# EAGLE design ProtoHu_rev_B_layer1 (EAGLE 9.4.0)
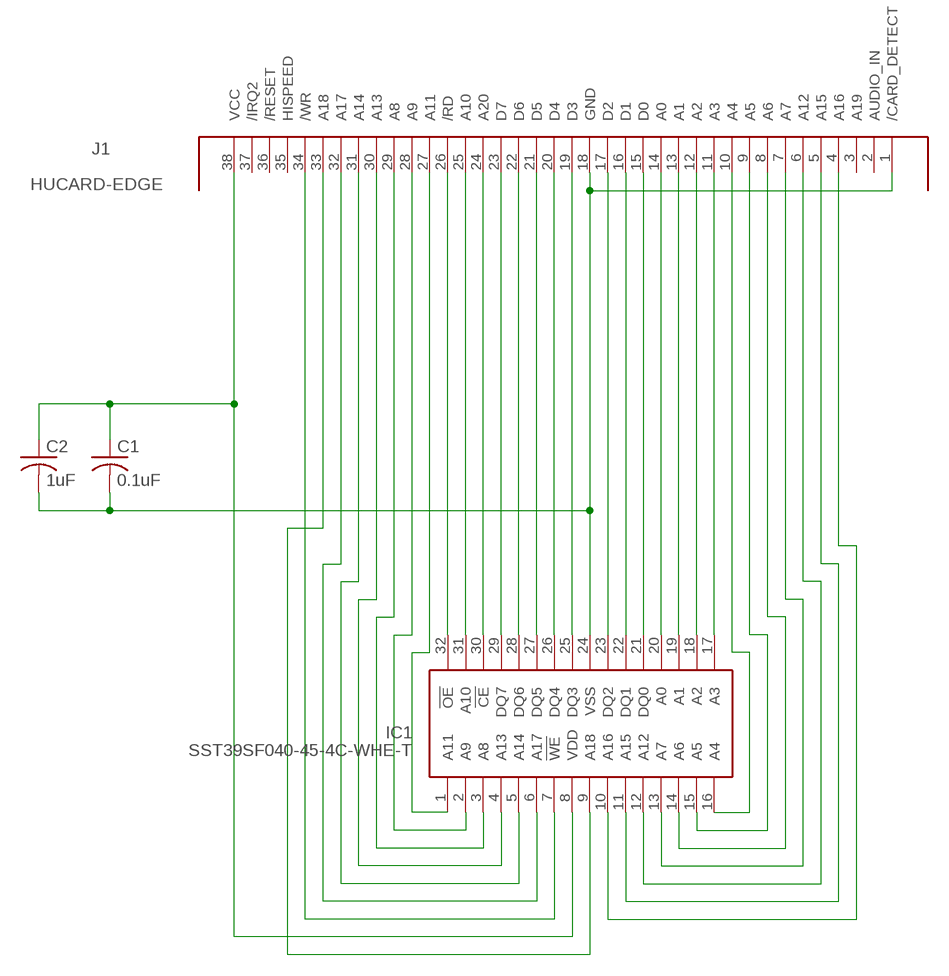
[diagram p0: schematic, sheet 1]

## Parts
C1  0.1uF  C-USC0603  [C0603]
C2  1uF  C-USC0603  [C0603]
IC1  SST39SF040-45-4C-WHE-T  [SOP50P1400X120-32N]
J1  HUCARD-EDGE  [HUCARD-EDGE]

## Nets
GND: C1.2 C2.2 IC1.24(VSS) J1.1(/CARD_DETECT) J1.18(GND)
N$2: IC1.13(A7) J1.7(A7)
N$3: IC1.12(A12) J1.6(A12)
N$4: IC1.25(DQ3) J1.19(D3)
N$5: IC1.14(A6) J1.8(A6)
N$7: IC1.11(A15) J1.5(A15)
N$8: IC1.10(A16) J1.4(A16)
N$12: IC1.16(A4) J1.10(A4)
N$14: IC1.15(A5) J1.9(A5)
N$15: IC1.17(A3) J1.11(A3)
N$16: IC1.18(A2) J1.12(A2)
N$17: IC1.31(A10) J1.25(A10)
N$18: IC1.32(!OE) J1.26(/RD)
N$19: IC1.1(A11) J1.27(A11)
N$20: IC1.2(A9) J1.28(A9)
N$25: IC1.3(A8) J1.29(A8)
N$26: IC1.19(A1) J1.13(A1)
N$27: IC1.20(A0) J1.14(A0)
N$28: IC1.21(DQ0) J1.15(D0)
N$31: IC1.9(A18) J1.33(A18)
N$33: IC1.7(!WE) J1.34(/WR)
N$34: IC1.22(DQ1) J1.16(D1)
N$35: IC1.6(A17) J1.32(A17)
N$36: IC1.5(A14) J1.31(A14)
N$37: IC1.4(A13) J1.30(A13)
N$38: IC1.23(DQ2) J1.17(D2)
N$42: IC1.30(!CE) J1.24(A20)
N$43: IC1.29(DQ7) J1.23(D7)
N$44: IC1.28(DQ6) J1.22(D6)
N$45: IC1.26(DQ4) J1.20(D4)
N$46: IC1.27(DQ5) J1.21(D5)
VCC: C1.1 C2.1 IC1.8(VDD) J1.38(VCC)
Unconnected: J1.2(AUDIO_IN) J1.3(A19) J1.35(HISPEED) J1.36(/RESET) J1.37(/IRQ2)

## Library data of the parts
C1 C2 = resistor:C-US: CAPACITOR, American symbol
IC1 = PC-Engine:SST39SF040-45-4C-WHE-T: Flash Memory 4.5 to 5.5 4Mbit Multi-Purpose Flash Source: Datasheet <https://componentsearchengine.com/Datasheets/1/SST39SF040-45-4C-WHE-T.pdf>; DESCRIPTION: Flash Memory 4.5 to 5.5 4Mbit Multi-Purpose Flash; HEIGHT: 1.2mm; MANUFACTURER_NAME: Microchip; MANUFACTURER_PART_NUMBER: SST39SF040-45-4C-WHE-T; MOUSER_PART_NUMBER: 579-39SF0404CWHET; MOUSER_PRICE-STOCK: https://www.mouser.com/Search/Refine.aspx?Keyword=579-39SF0404CWHET
J1 = PC-Engine:HUCARD-EDGE: This is a card-edge connector for PC Engine HuCards. The package origin identifies the corner of an un-mitered HuCard. There is a mask 'kepout' area at the edges to allow for artwork/soldermask at the edge

## Board
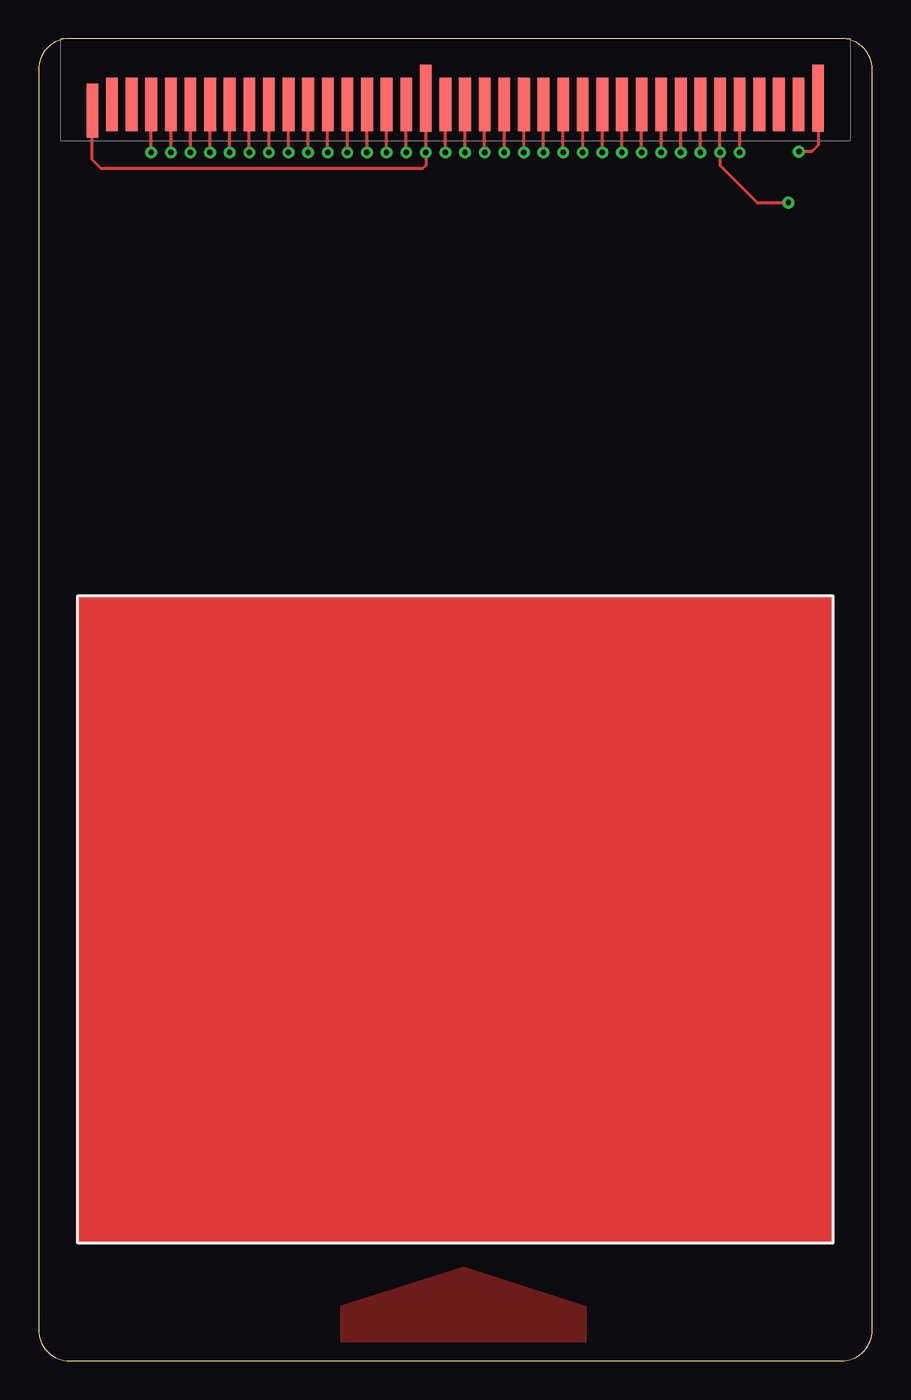
[diagram p1: board, top side]
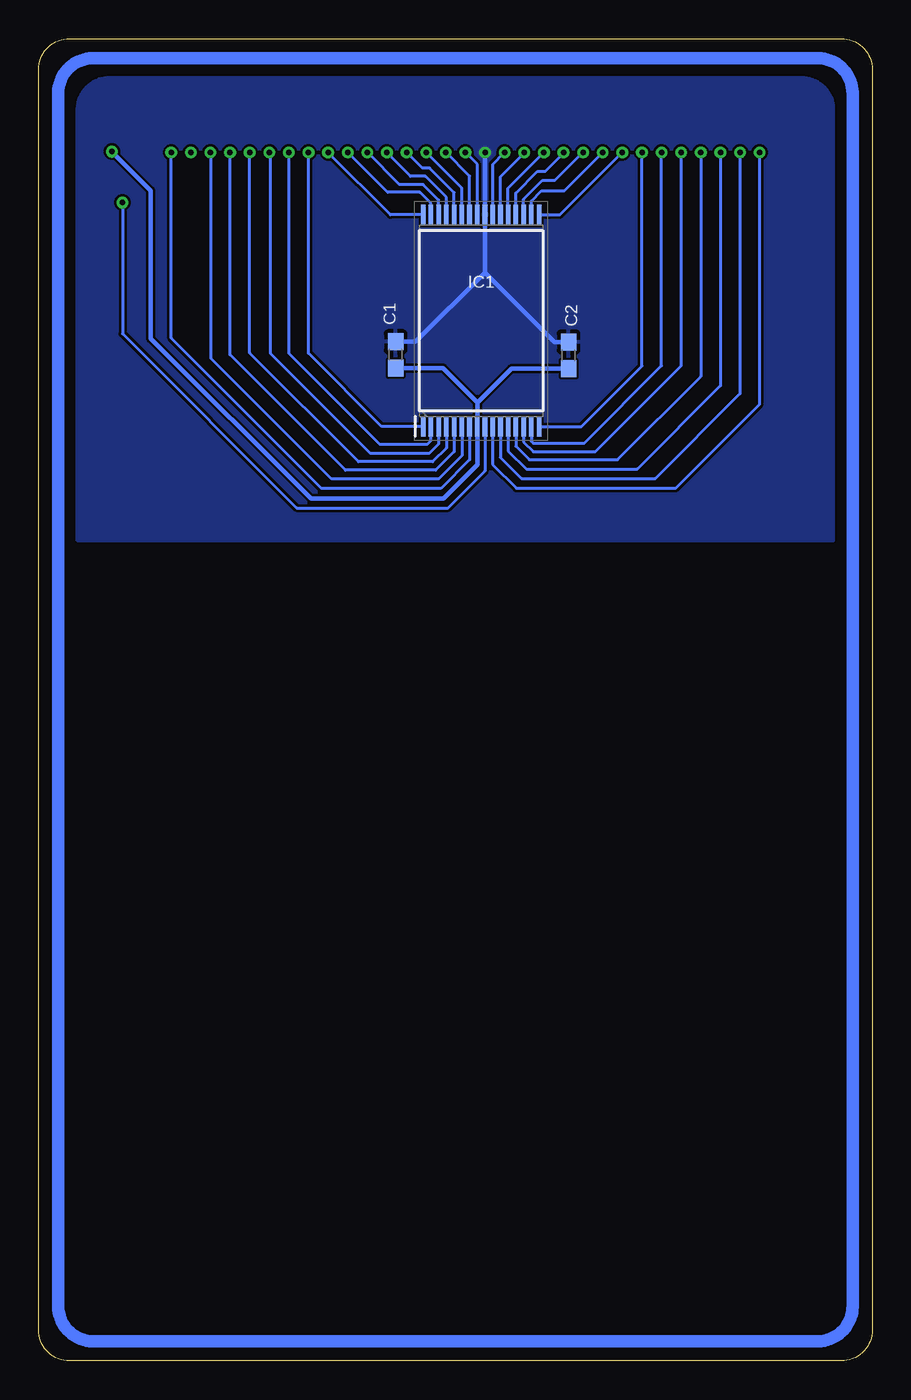
[diagram p2: board, bottom side, seen from below]

Size 53.98 x 85.6 mm. Coordinates in mm from the lower left corner, seen from the top.
Outline: 0,83.6 0,2 arc90 2,0 51.98,0 arc90 53.98,2 53.98,83.6 arc90 51.98,85.6 2,85.6 arc90 0,83.6
Copper layers (1*16): Top 0.035mm / dielectric 1.5mm / Bottom 0.035mm
Design rules "default *": minimum track width 6mil, minimum drill 0.35mm, track to track 6mil, track to pad 6mil, pad to pad 6mil, via to via 6mil, smd to smd 6mil, copper to edge 30mil, drill to drill 6mil, minimum pad ring 10mil, minimum via ring 8mil, stop-mask expansion 4mil, vias tented up to drill 15mil, thermal gap 10mil

### Footprints (pad centres in the part's own frame; a part is rotated, then mirrored left to right if it is on the bottom)
C0603 = smd 1.1 x 1: 1 -0.85,0; 2 0.85,0
SOP50P1400X120-32N = smd 1.3 x 0.3: 1 -6.85,3.75; 2 -6.85,3.25; 3 -6.85,2.75; 4 -6.85,2.25; 5 -6.85,1.75; 6 -6.85,1.25; 7 -6.85,0.75; 8 -6.85,0.25; 9 -6.85,-0.25; 10 -6.85,-0.75; 11 -6.85,-1.25; 12 -6.85,-1.75; 13 -6.85,-2.25; 14 -6.85,-2.75; 15 -6.85,-3.25; 16 -6.85,-3.75; 17 6.85,-3.75; 18 6.85,-3.25; 19 6.85,-2.75; 20 6.85,-2.25; 21 6.85,-1.75; 22 6.85,-1.25; 23 6.85,-0.75; 24 6.85,-0.25; 25 6.85,0.25; 26 6.85,0.75; 27 6.85,1.25; 28 6.85,1.75; 29 6.85,2.25; 30 6.85,2.75; 31 6.85,3.25; 32 6.85,3.75
HUCARD-EDGE = smd 0.762 x 3.48: 1 3.48,-4.674; 2 4.75,-4.267; 3 6.02,-4.267; 4 7.29,-4.267; 5 8.56,-4.267; 6 9.83,-4.267; 7 11.1,-4.267; 8 12.37,-4.267; 9 13.64,-4.267; 10 14.91,-4.267; 11 16.18,-4.267; 12 17.45,-4.267; 13 18.72,-4.267; 14 19.99,-4.267; 15 21.26,-4.267; 16 22.53,-4.267; 17 23.8,-4.267; 19 26.34,-4.267; 20 27.61,-4.267; 21 28.88,-4.267; 22 30.15,-4.267; 23 31.42,-4.267; 24 32.69,-4.267; 25 33.96,-4.267; 26 35.23,-4.267; 27 36.5,-4.267; 28 37.77,-4.267; 29 39.04,-4.267; 30 40.31,-4.267; 31 41.58,-4.267; 32 42.85,-4.267; 33 44.12,-4.267; 34 45.39,-4.267; 35 46.66,-4.267; 36 47.93,-4.267; 37 49.2,-4.267 | smd 0.762 x 4.318: 18 25.07,-3.861; 38 50.47,-3.861

### Placement (x,y rotation side)
C1  30.86,65.13 90 bottom
C2  19.66,65.1 90 bottom
IC1  25.32,67.34 90 bottom
J1  0,85.6 0 top

### Tracks (layer width: path | path; a pad name or v marks a point on that pad's centre or on a via)
GND  (via drill 0.35)
  Top 0.203: J1.1 3.48,77.75 4.04,77.19 24.87,77.19 25.07,77.39 v25.07,78.23 J1.18
  Bottom 0.305: 25.07,70.46 IC1.24 v25.07,78.23 | 25.07,70.46 29.56,65.98 C1.2 | C2.2 20.56,65.95 25.07,70.46
  pour Bottom: 2.54,53.11 51.44,53.11 51.44,81.06 arc90 49.33,83.06 4.62,83.06 arc90 2.54,81.06
N$2  (via drill 0.35)
  Top 0.203: v11.1,78.23 J1.7
  Bottom 0.203: v11.1,78.23 11.1,63.73 16.48,58.34 22.2,58.34 23.07,59.22 IC1.13
N$3  (via drill 0.35)
  Top 0.203: v9.83,78.23 J1.6
  Bottom 0.203: v9.83,78.23 9.83,63.12 15.21,57.73 22.4,57.73 23.57,58.91 IC1.12
N$4  (via drill 0.35)
  Top 0.203: v26.34,78.23 J1.19
  Bottom 0.203: v26.34,78.23 25.57,77.47 IC1.25
N$5  (via drill 0.35)
  Top 0.203: v12.37,78.23 J1.8
  Bottom 0.203: v12.37,78.23 12.37,64.41 17.93,58.85 21.95,58.85 22.57,59.48 IC1.14
N$7  (via drill 0.35)
  Top 0.203: J1.5 v8.56,78.23
  Bottom 0.203: v8.56,78.23 8.56,62.61 14.05,57.12 22.71,57.12 24.07,58.49 IC1.11
N$8  (via drill 0.35)
  Top 0.203: v7.29,78.23 J1.4
  Bottom 0.203: v7.29,78.23 7.29,61.92 12.72,56.49 23.04,56.49 24.57,58.03 IC1.10
N$12  (via drill 0.35)
  Top 0.203: v14.91,78.23 J1.10
  Bottom 0.203: IC1.16 18.82,60.48 14.91,64.4 v14.91,78.23
N$13
  Bottom 0.813: 1.27,82.07 arc-90 3.52,84.33 | 3.52,84.33 50.45,84.33 arc-90 52.7,82.07 52.7,3.55 arc-90 50.45,1.27 50.38,1.27 3.52,1.27 arc-90 1.27,3.55 | 1.27,3.6 1.27,82.07 | 1.27,82.07 1.27,82.12 | 1.27,82.07 arc-90 3.52,84.33
N$14  (via drill 0.35)
  Top 0.203: v13.64,78.23 J1.9
  Bottom 0.203: v13.64,78.23 13.64,64.41 18.64,59.41 21.95,59.41 22.07,59.54 IC1.15
N$15  (via drill 0.35)
  Top 0.203: v16.18,78.23 J1.11
  Bottom 0.203: IC1.17 20.23,74.19 v16.18,78.23
N$16  (via drill 0.35)
  Top 0.203: v17.45,78.23 J1.12
  Bottom 0.203: IC1.18 22.07,75.08 21.41,75.74 19.94,75.74 v17.45,78.23
N$17  (via drill 0.35)
  Top 0.203: v33.96,78.23 J1.25
  Bottom 0.203: IC1.31 28.57,74.93 29.29,75.64 31.37,75.64 v33.96,78.23
N$18  (via drill 0.35)
  Top 0.203: v35.23,78.23 J1.26
  Bottom 0.203: IC1.32 31.19,74.19 v35.23,78.22 v35.23,78.23
N$19  (via drill 0.35)
  Top 0.203: v36.5,78.23 J1.27
  Bottom 0.203: IC1.1 31.76,60.48 36.5,65.23 v36.5,78.23
N$20  (via drill 0.35)
  Top 0.203: v37.77,78.23 J1.28
  Bottom 0.203: v37.77,78.23 37.74,78.21 37.74,65.2 31.9,59.36 28.78,59.36 28.57,59.56 IC1.2
N$25  (via drill 0.35)
  Top 0.203: v39.04,78.23 J1.29
  Bottom 0.203: v39.04,78.23 38.94,78.13 38.94,65.19 32.49,58.75 28.68,58.75 28.07,59.36 IC1.3
N$26  (via drill 0.35)
  Top 0.203: v18.72,78.23 J1.13
  Bottom 0.203: IC1.19 22.57,75.19 21.34,76.43 20.55,76.43 18.75,78.23 v18.72,78.23
N$27  (via drill 0.35)
  Top 0.203: v19.99,78.23 J1.14
  Bottom 0.203: v19.99,78.23 19.99,78.18 21.16,77.01 21.67,77.01 23.07,75.61 IC1.20
N$28  (via drill 0.35)
  Top 0.203: v21.26,78.23 J1.15
  Bottom 0.203: IC1.21 23.57,75.92 v21.26,78.23
N$31  (via drill 0.35)
  Top 0.203: J1.33 v44.12,78.23 44.12,77.39 46.53,74.98 v48.54,74.98
  Bottom 0.203: IC1.9 25.07,57.61 27.46,55.22 37.26,55.22 48.54,66.5 v48.54,74.98
N$33  (via drill 0.35)
  Top 0.203: v45.39,78.23 J1.34
  Bottom 0.203: v45.39,78.23 45.39,66.22 35.66,56.48 27.92,56.48 26.07,58.33 IC1.7
N$34  (via drill 0.35)
  Top 0.203: v22.53,78.23 J1.16
  Bottom 0.203: IC1.22 24.07,76.66 22.53,78.2 v22.53,78.23
N$35  (via drill 0.35)
  Top 0.203: v42.85,78.23 J1.32
  Bottom 0.203: IC1.6 26.57,58.6 28.07,57.1 35,57.1 42.82,64.92 42.82,78.21 v42.85,78.23
N$36  (via drill 0.35)
  Top 0.203: v41.58,78.23 J1.31
  Bottom 0.203: v41.58,78.23 41.58,65.13 34.11,57.66 28.27,57.66 27.07,58.85 IC1.5
N$37  (via drill 0.35)
  Top 0.203: v40.31,78.23 J1.30
  Bottom 0.203: IC1.4 27.57,59.11 28.46,58.22 33.27,58.22 40.31,65.25 v40.31,78.23
N$38  (via drill 0.35)
  Top 0.203: v23.8,78.23 J1.17
  Bottom 0.203: v23.8,78.23 24.59,77.44 24.59,74.2 IC1.23
N$42  (via drill 0.35)
  Top 0.203: v32.69,78.23 J1.24
  Bottom 0.203: v32.69,78.23 30.61,76.15 29.08,76.15 28.07,75.14 IC1.30
N$43  (via drill 0.35)
  Top 0.203: v31.42,78.23 J1.23
  Bottom 0.203: v31.42,78.23 31.42,78.21 29.9,76.68 28.93,76.68 27.57,75.33 IC1.29
N$44  (via drill 0.35)
  Top 0.203: v30.15,78.23 J1.22
  Bottom 0.203: v30.15,78.23 29.13,77.22 28.65,77.22 27.07,75.64 IC1.28
N$45  (via drill 0.35)
  Top 0.203: v27.61,78.23 J1.20
  Bottom 0.203: IC1.26 26.07,76.7 v27.61,78.23
N$46  (via drill 0.35)
  Top 0.203: v28.88,78.23 J1.21
  Bottom 0.203: v28.88,78.23 26.57,75.93 IC1.27
N$110
  pour Top: 27.51,6.05 19.56,3.55 19.56,1.24 35.48,1.24 35.48,3.52
VCC  (via drill 0.35)
  Top 0.203: J1.38 50.49,81.71 50.49,78.72 50.06,78.28 v49.23,78.28
  Bottom 0.305: v49.23,78.28 49.23,78.26 46.71,75.74 46.71,66.19 36.35,55.83 27.76,55.83 25.57,58.02 IC1.8 25.57,62.05 | 25.57,62.05 27.8,64.28 C1.1 | C2.1 23.37,64.25 25.57,62.05
(copper drawn outside any net)
  shapes: Top area x1

### Text on the board
bValues: JLCJLCJLCJLC
tStop: Multi-Backup / Megavault | Prototype by / David Shadoff | Prototype / ver. B